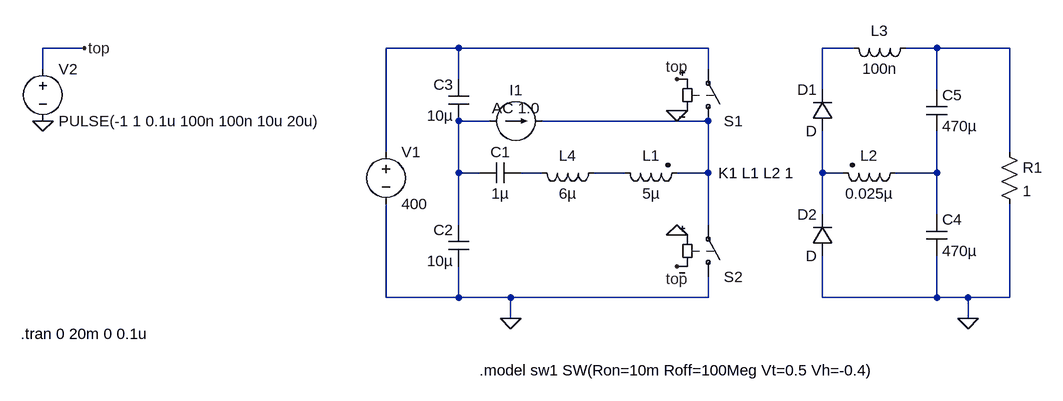
[diagram p0: schematic isolated-storageless.asc]
isolated-storageless.asc, the LTspice schematic file:
Version 4
SHEET 1 1320 680
WIRE -608 -32 -672 -32
WIRE -32 -32 -144 -32
WIRE 352 -32 -32 -32
WIRE 576 -32 528 -32
WIRE 704 -32 656 -32
WIRE 816 -32 704 -32
WIRE -672 0 -672 -32
WIRE 352 0 352 -32
WIRE -32 16 -32 -32
WIRE 528 32 528 -32
WIRE 704 32 704 -32
WIRE 16 80 -32 80
WIRE 352 80 96 80
WIRE -144 128 -144 -32
WIRE 816 128 816 -32
WIRE -32 160 -32 80
WIRE 0 160 -32 160
WIRE 96 160 64 160
WIRE 224 160 176 160
WIRE 352 160 352 80
WIRE 352 160 304 160
WIRE 528 160 528 96
WIRE 560 160 528 160
WIRE 704 160 704 96
WIRE 704 160 640 160
WIRE 528 224 528 160
WIRE 704 224 704 160
WIRE -32 240 -32 160
WIRE 352 240 352 160
WIRE -144 352 -144 208
WIRE -32 352 -32 304
WIRE -32 352 -144 352
WIRE 48 352 -32 352
WIRE 352 352 352 320
WIRE 352 352 48 352
WIRE 528 352 528 288
WIRE 704 352 704 288
WIRE 704 352 528 352
WIRE 752 352 704 352
WIRE 816 352 816 208
WIRE 816 352 752 352
WIRE 48 384 48 352
WIRE 752 384 752 352
FLAG 48 384 0
FLAG 304 64 0
FLAG 304 256 0
FLAG 752 384 0
FLAG -672 80 0
FLAG -608 -32 top
FLAG 304 16 top
FLAG 304 304 top
SYMBOL voltage -144 112 R0
WINDOW 123 0 0 Left 2
WINDOW 39 0 0 Left 2
SYMATTR InstName V1
SYMATTR Value 400
SYMBOL sw 352 96 M180
SYMATTR InstName S1
SYMATTR Value ""
SYMATTR SpiceModel sw1
SYMBOL sw 352 336 M180
SYMATTR InstName S2
SYMATTR Value ""
SYMATTR SpiceModel sw1
SYMBOL cap 64 144 R90
WINDOW 0 0 32 VBottom 2
WINDOW 3 32 32 VTop 2
SYMATTR InstName C1
SYMATTR Value 1µ
SYMATTR SpiceLine Rser=10m
SYMBOL cap -16 304 R180
WINDOW 0 24 56 Left 2
WINDOW 3 24 8 Left 2
SYMATTR InstName C2
SYMATTR Value 10µ
SYMBOL cap -16 80 R180
WINDOW 0 24 56 Left 2
WINDOW 3 24 8 Left 2
SYMATTR InstName C3
SYMATTR Value 10µ
SYMBOL ind2 208 144 M90
WINDOW 0 5 56 VBottom 2
WINDOW 3 32 56 VTop 2
SYMATTR InstName L1
SYMATTR Value 5µ
SYMATTR Type ind
SYMATTR SpiceLine Rser=10m
SYMBOL ind2 656 144 R90
WINDOW 0 5 56 VBottom 2
WINDOW 3 32 56 VTop 2
SYMATTR InstName L2
SYMATTR Value 0.025µ
SYMATTR Type ind
SYMATTR SpiceLine Rser=1m
SYMBOL diode 544 96 R180
WINDOW 0 24 64 Left 2
WINDOW 3 24 0 Left 2
SYMATTR InstName D1
SYMBOL diode 544 288 R180
WINDOW 0 24 64 Left 2
WINDOW 3 24 0 Left 2
SYMATTR InstName D2
SYMBOL cap 688 224 R0
SYMATTR InstName C4
SYMATTR Value 470µ
SYMBOL cap 688 32 R0
SYMATTR InstName C5
SYMATTR Value 470µ
SYMBOL res 800 112 R0
SYMATTR InstName R1
SYMATTR Value 1
SYMBOL voltage -672 -16 R0
WINDOW 123 24 124 Left 2
WINDOW 39 0 0 Left 2
SYMATTR InstName V2
SYMATTR Value PULSE(-1 1 0.1u 100n 100n 10u 20u)
SYMBOL current 16 80 R270
WINDOW 0 32 40 VTop 2
WINDOW 3 -32 40 Invisible 2
WINDOW 123 4 40 VTop 2
WINDOW 39 0 0 Left 2
SYMATTR InstName I1
SYMATTR Value 0
SYMATTR Value2 AC 1.0
SYMBOL ind 672 -48 R90
WINDOW 0 5 56 VBottom 2
WINDOW 3 32 56 VTop 2
SYMATTR InstName L3
SYMATTR Value 100n
SYMATTR SpiceLine Rser=1m
SYMBOL ind 192 144 R90
WINDOW 0 5 56 VBottom 2
WINDOW 3 32 56 VTop 2
SYMATTR InstName L4
SYMATTR Value 6µ
TEXT 368 160 Left 2 !K1 L1 L2 1
TEXT -706 408 Left 2 !.tran 0 20m 0 0.1u
TEXT 0 464 Left 2 !.model sw1 SW(Ron=10m Roff=100Meg Vt=0.5 Vh=-0.4)

The netlist it stands for:
* isolated-storageless.asc
V1 N001 0 400
S1 N005 N001 top 0 sw1
S2 0 N005 0 top sw1
C1 N006 N004 1µ Rser=10m
C2 0 N004 10µ
C3 N004 N001 10µ
L1 N007 N005 5µ Rser=10m
L2 N009 N008 0.025µ Rser=1m
D1 N008 N002 D
D2 0 N008 D
C4 N009 0 470µ
C5 N003 N009 470µ
R1 N003 0 1
V2 top 0 PULSE(-1 1 0.1u 100n 100n 10u 20u)
I1 N004 N005 0 AC 1.0
L3 N003 N002 100n Rser=1m
L4 N007 N006 6µ
.model D D
.lib standard.dio
K1 L1 L2 1
.tran 0 20m 0 0.1u
.model sw1 SW(Ron=10m Roff=100Meg Vt=0.5 Vh=-0.4)
.backanno
.end